# Altium schematic sheet Muller-C3.SchDoc
size 425 x 409 mm
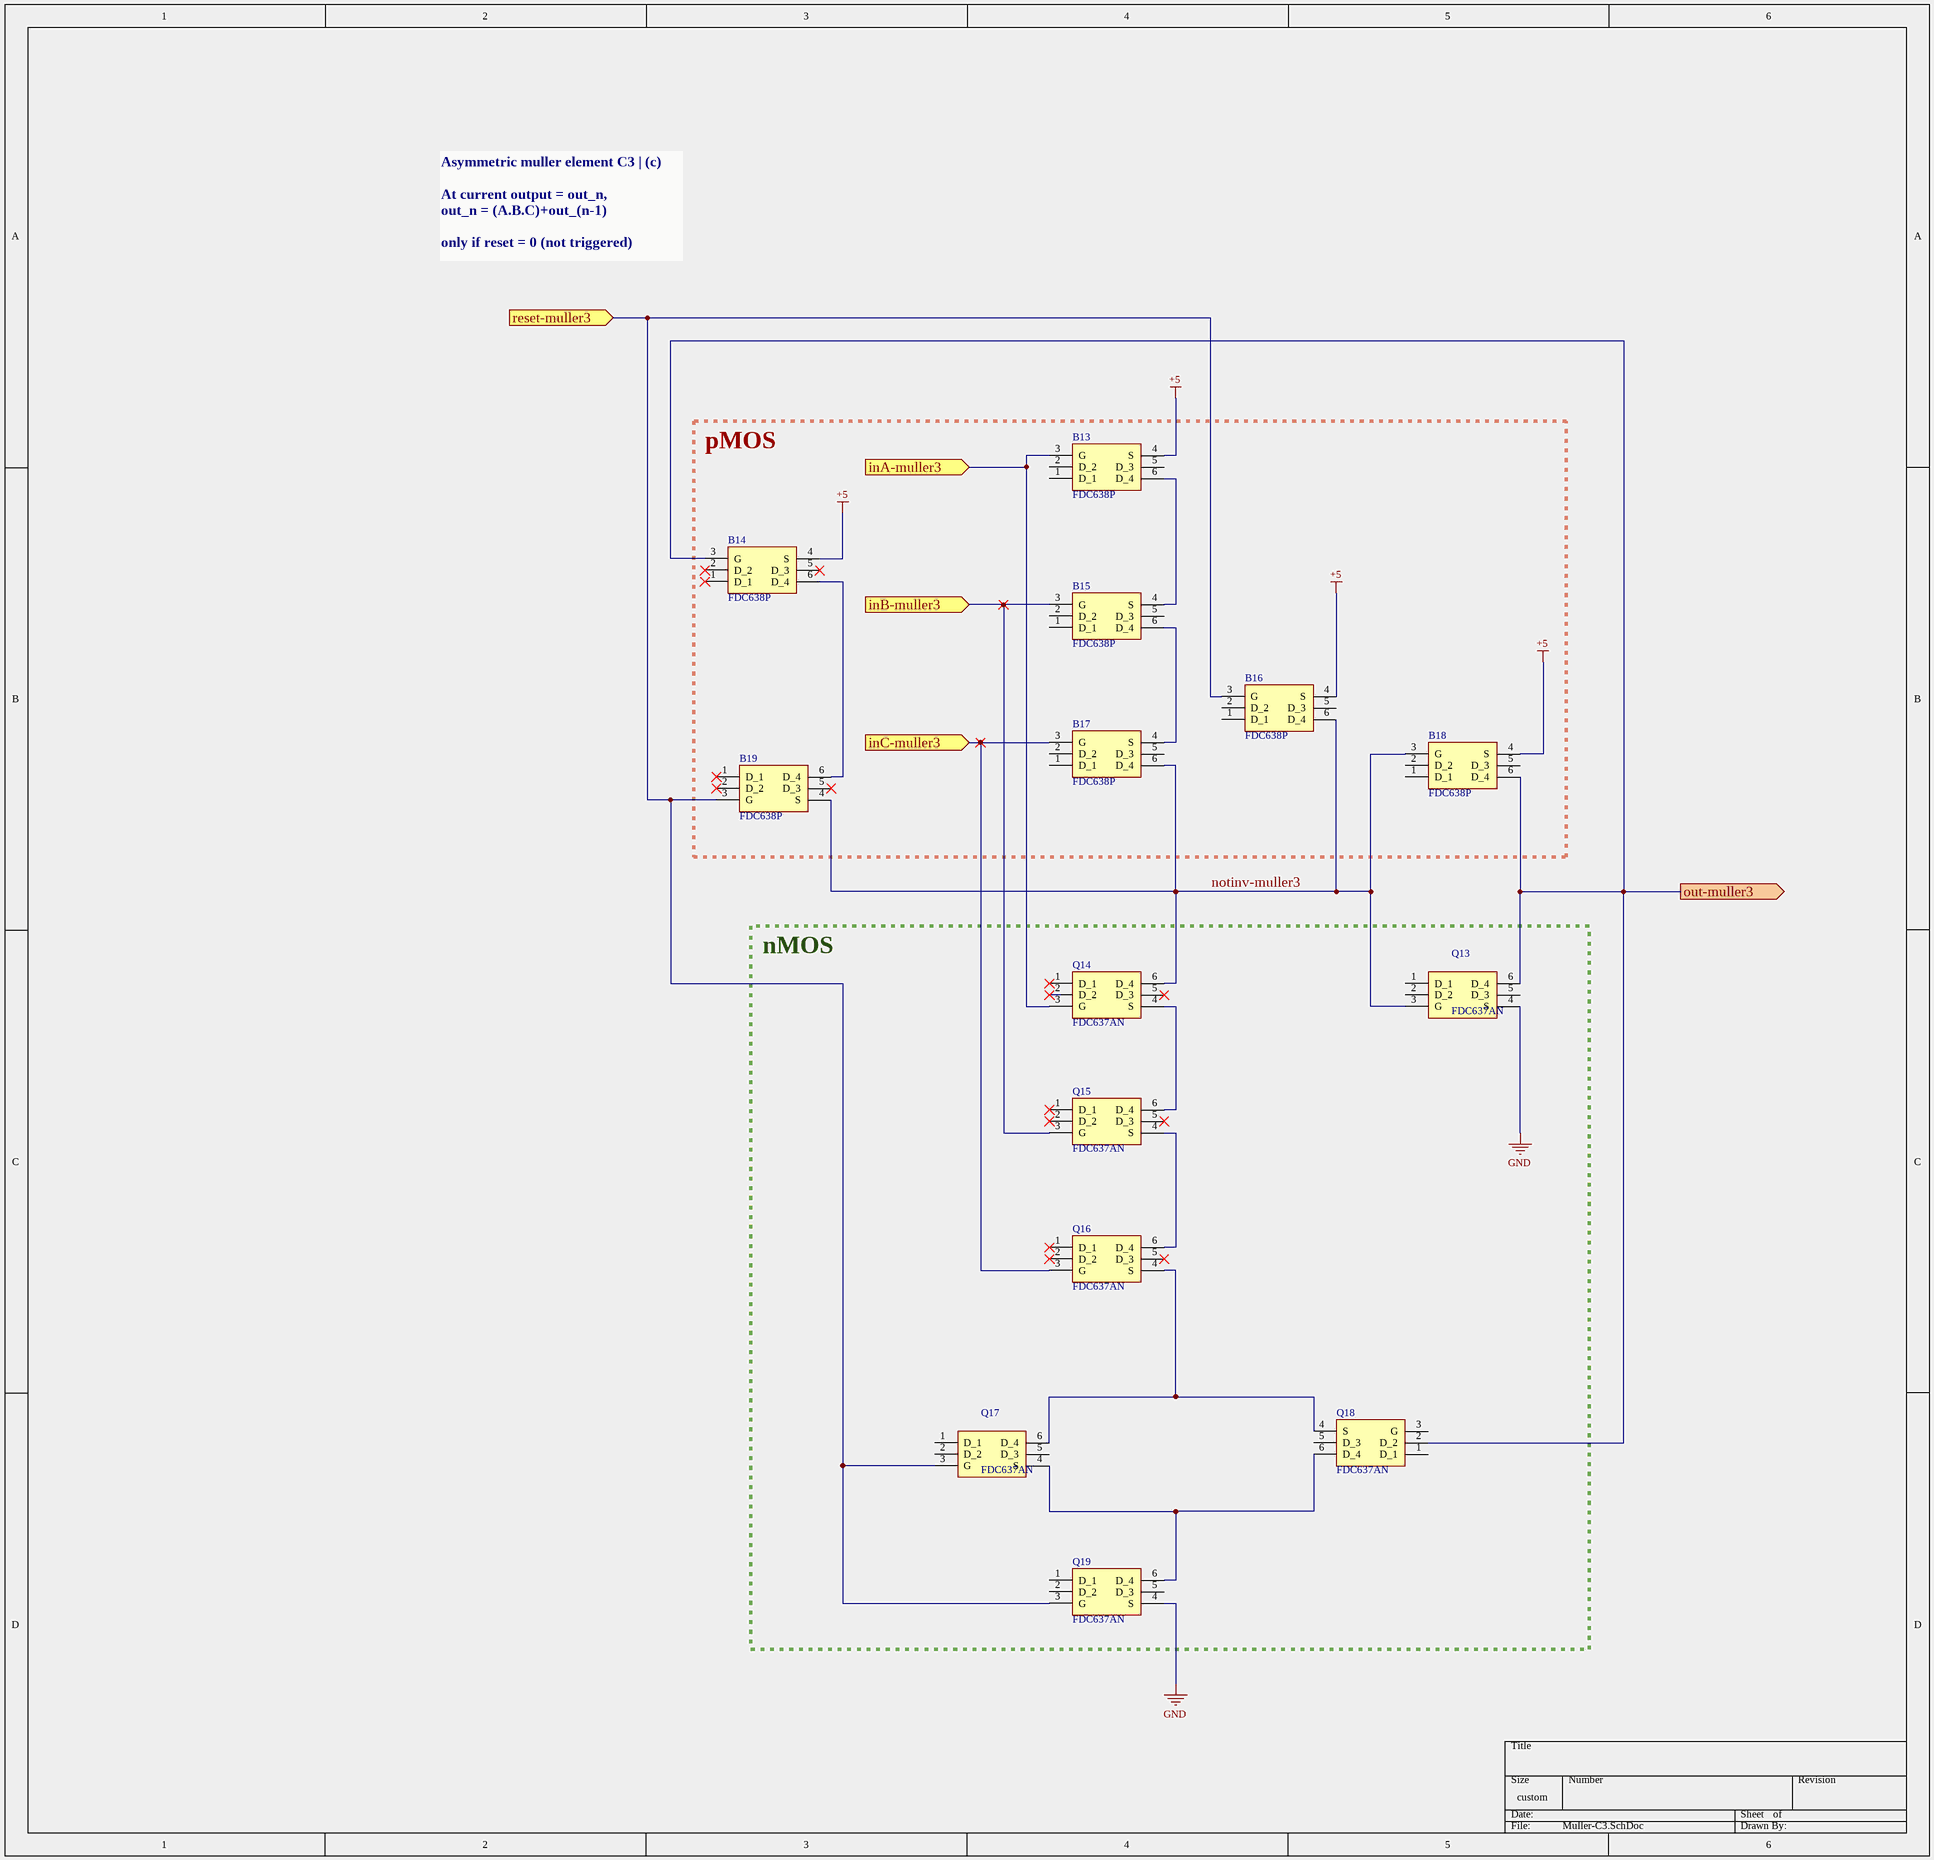
[diagram p0: Muller-C3.SchDoc]

## Parts
B13  FDC638P  [SOT95P275X110-6N]
B14  FDC638P  [SOT95P275X110-6N]
B15  FDC638P  [SOT95P275X110-6N]
B16  FDC638P  [SOT95P275X110-6N]
B17  FDC638P  [SOT95P275X110-6N]
B18  FDC638P  [SOT95P275X110-6N]
B19  FDC638P  [SOT95P275X110-6N]
Q13  FDC637AN  [SOT95P275X110-6N]
Q14  FDC637AN  [SOT95P275X110-6N]
Q15  FDC637AN  [SOT95P275X110-6N]
Q16  FDC637AN  [SOT95P275X110-6N]
Q17  FDC637AN  [SOT95P275X110-6N]
Q18  FDC637AN  [SOT95P275X110-6N]
Q19  FDC637AN  [SOT95P275X110-6N]

## Blocks framed on the sheet
pMOS: B13-B19
nMOS: Q13-Q19

## Ports
inA-muller3 (in), inB-muller3 (in), inC-muller3 (in), out-muller3 (out), reset-muller3 (in)

## Nets
+5: B13.4(S) B14.4(S) B16.4(S) B18.4(S)
GND: Q13.4(S) Q19.4(S)
inA-muller3: B13.3(G) Q14.3(G) ; port inA-muller3
inB-muller3: B15.3(G) Q15.3(G) ; port inB-muller3
inC-muller3: B17.3(G) Q16.3(G) ; port inC-muller3
notinv-muller3: B16.6(D_4) B17.6(D_4) B18.3(G) B19.4(S) Q13.3(G) Q14.6(D_4)
out-muller3: B14.3(G) B18.6(D_4) Q13.6(D_4) Q18.2(D_2) ; port out-muller3
reset-muller3: B16.3(G) B19.3(G) Q17.3(G) Q19.3(G) ; port reset-muller3
NetB13_6: B13.6(D_4) B15.4(S)
NetB14_6: B14.6(D_4) B19.6(D_4)
NetB15_6: B15.6(D_4) B17.4(S)
NetQ14_4: Q14.4(S) Q15.6(D_4)
NetQ15_4: Q15.4(S) Q16.6(D_4)
NetQ16_4: Q16.4(S) Q17.6(D_4) Q18.4(S)
NetQ17_4: Q17.4(S) Q18.6(D_4) Q19.6(D_4)

Not connected (* = marked no-connect by the designer): B13 1(D_1) 2(D_2) 5(D_3); B14 1(D_1)* 2(D_2)* 5(D_3)*; B15 1(D_1) 2(D_2) 5(D_3); B16 1(D_1) 2(D_2) 5(D_3); B17 1(D_1) 2(D_2) 5(D_3); B18 1(D_1) 2(D_2) 5(D_3); B19 1(D_1)* 2(D_2)* 5(D_3)*; Q13 1(D_1) 2(D_2) 5(D_3); Q14 1(D_1)* 2(D_2)* 5(D_3)*; Q15 1(D_1)* 2(D_2)* 5(D_3)*; Q16 1(D_1)* 2(D_2)* 5(D_3)*; Q17 1(D_1) 2(D_2) 5(D_3); Q18 1(D_1) 3(G) 5(D_3); Q19 1(D_1) 2(D_2) 5(D_3)

## Notes on the sheet
- Asymmetric muller element C3 | (c)
  At current output = out_n,
  out_n = (A.B.C)+out_(n-1)
  only if reset = 0 (not triggered)

## Library data of the parts
B13-B19 = CMP-007-000000-1: Low gate charge (10 nC typical); Manufacturer_Name: onsemi; Geometry.Height: 1.1mm; Datasheet Link: https://www.onsemi.com/pub/Collateral/FDC638P-D.PDF; Arrow Price/Stock: *; Design Item ID: FDC638P; Mouser Part Number: 512-FDC638P; Manufacturer_Part_Number: FDC638P; Mouser Price/Stock: https://www.mouser.co.uk/ProductDetail/onsemi-Fairchild/FDC638P?qs=FOlmdCx%252BAA16kOuf%252Brkheg%3D%3D; Source: FDC638P.SchLib; Arrow Part Number: *
Q13-Q19 = CMP-005-000000-4: Low gate charge (10.5nC typical).; Manufacturer_Name: onsemi; Geometry.Height: 1.1mm; Mouser Part Number: 512-FDC637AN; Source: FDC637AN.SchLib; Arrow Part Number: FDC637AN; Datasheet Link: https://www.onsemi.com/pub/Collateral/FDC637AN-D.PDF; Arrow Price/Stock: https://www.arrow.com/en/products/fdc637an/on-semiconductor?region=nac; Manufacturer_Part_Number: FDC637AN; Mouser Price/Stock: https://www.mouser.co.uk/ProductDetail/ON-Semiconductor-Fairchild/FDC637AN?qs=utFvTgNEmG6iAEUdTAueXw%3D%3D; Design Item ID: FDC637AN